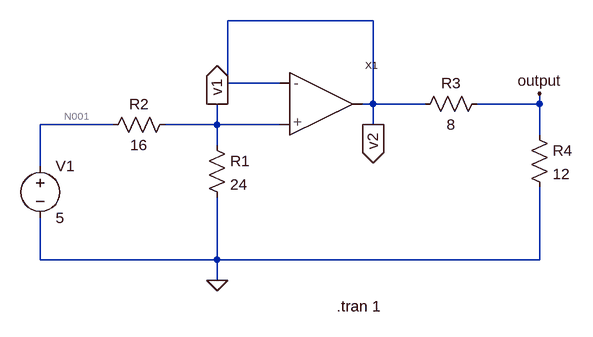
[diagram p0: schematic Draft2.asc]
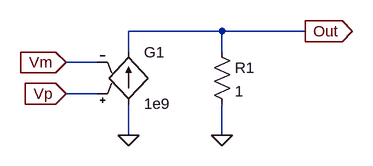
[diagram p1: sub-circuit op_amp.asc]
Draft2.asc, the LTspice schematic file:
Version 4
SHEET 1 880 680
WIRE 304 0 80 0
WIRE 80 96 80 0
WIRE 160 96 80 96
WIRE 304 128 304 0
WIRE 304 128 288 128
WIRE 384 128 304 128
WIRE 560 128 560 112
WIRE 560 128 464 128
WIRE -96 160 -208 160
WIRE 64 160 64 128
WIRE 64 160 -16 160
WIRE 160 160 64 160
WIRE 304 160 304 128
WIRE 560 176 560 128
WIRE 64 192 64 160
WIRE -208 224 -208 160
WIRE -208 368 -208 304
WIRE 64 368 64 272
WIRE 64 368 -208 368
WIRE 560 368 560 256
WIRE 560 368 64 368
WIRE 64 400 64 368
FLAG 64 400 0
FLAG 304 160 v2
IOPIN 304 160 Out
FLAG 64 128 v1
IOPIN 64 128 Out
FLAG 560 112 output
SYMBOL op_amp 176 128 R0
SYMATTR InstName X1
SYMBOL res 48 176 R0
SYMATTR InstName R1
SYMATTR Value 24
SYMBOL res 0 144 R90
WINDOW 0 0 56 VBottom 2
WINDOW 3 32 56 VTop 2
SYMATTR InstName R2
SYMATTR Value 16
SYMBOL voltage -208 208 R0
WINDOW 123 0 0 Left 0
WINDOW 39 0 0 Left 0
SYMATTR InstName V1
SYMATTR Value 5
SYMBOL res 480 112 R90
WINDOW 0 0 56 VBottom 2
WINDOW 3 32 56 VTop 2
SYMATTR InstName R3
SYMATTR Value 8
SYMBOL res 544 160 R0
SYMATTR InstName R4
SYMATTR Value 12
TEXT 248 440 Left 2 !.tran 1

op_amp.asc, the sub-circuit schematic file:
Version 4
SHEET 1 880 680
WIRE 304 176 160 176
WIRE 432 176 304 176
WIRE 160 208 160 176
WIRE 304 208 304 176
WIRE 112 224 64 224
WIRE 112 272 64 272
WIRE 160 336 160 288
WIRE 304 336 304 288
FLAG 160 336 0
FLAG 304 336 0
FLAG 64 224 Vm
IOPIN 64 224 In
FLAG 64 272 Vp
IOPIN 64 272 In
FLAG 432 176 Out
IOPIN 432 176 Out
SYMBOL g2 160 192 R0
SYMATTR InstName G1
SYMATTR Value 1e9
SYMBOL res 288 192 R0
SYMATTR InstName R1
SYMATTR Value 1

The netlist it stands for:
* Draft2.asc
XX1 v2 v1 v2 op_amp
R1 v1 0 24
R2 v1 N001 16
V1 N001 0 5
R3 output v2 8
R4 output 0 12

* block symbol definitions
.subckt op_amp Vm Vp Out
G1 0 Out Vp Vm 1e9
R1 Out 0 1
.ends op_amp

.tran 1
.backanno
.end

* Results of the author's LTspice run, read from the files saved beside the schematic
* Operating Point, zero values left out:
*   V(v2) = 3 V
*   V(v1) = 3 V
*   V(n001) = 5 V
*   V(output) = 1.8 V
*   I(R1) = 125 mA
*   I(R2) = -125 mA
*   I(R3) = -150 mA
*   I(R4) = 150 mA
*   I(V1) = -125 mA
*   Ix(x1:OUT) = -150 mA